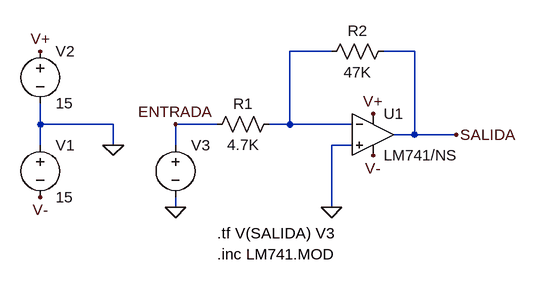
[diagram p0: schematic lm741-inversor-funcion-transferencia.asc]
lm741-inversor-funcion-transferencia.asc, the LTspice schematic file:
Version 4
SHEET 1 908 680
WIRE 352 48 288 48
WIRE 480 48 432 48
WIRE -96 160 -96 128
WIRE 16 160 -96 160
WIRE 176 160 112 160
WIRE 288 160 288 48
WIRE 288 160 256 160
WIRE 384 160 288 160
WIRE 480 176 480 48
WIRE 480 176 448 176
WIRE 544 176 480 176
WIRE -96 192 -96 160
WIRE 16 192 16 160
WIRE 112 192 112 160
WIRE 384 192 352 192
WIRE 112 288 112 272
WIRE 352 288 352 192
FLAG 112 288 0
FLAG 16 192 0
FLAG 544 176 SALIDA
FLAG -96 48 V+
FLAG 416 144 V+
FLAG -96 272 V-
FLAG 416 208 V-
FLAG 352 288 0
FLAG 112 160 ENTRADA
SYMBOL Opamps\\opamp2 416 112 R0
SYMATTR InstName U1
SYMATTR Value LM741/NS
SYMBOL voltage -96 176 R0
WINDOW 123 0 0 Left 0
WINDOW 39 0 0 Left 0
SYMATTR InstName V1
SYMATTR Value 15
SYMBOL voltage -96 32 R0
WINDOW 123 0 0 Left 0
WINDOW 39 0 0 Left 0
SYMATTR InstName V2
SYMATTR Value 15
SYMBOL voltage 112 176 R0
WINDOW 123 0 0 Left 0
WINDOW 39 0 0 Left 0
SYMATTR InstName V3
SYMATTR Value ""
SYMBOL res 448 32 R90
WINDOW 0 0 56 VBottom 2
WINDOW 3 32 56 VTop 2
SYMATTR InstName R2
SYMATTR Value 47K
SYMBOL res 272 144 R90
WINDOW 0 0 56 VBottom 2
WINDOW 3 32 56 VTop 2
SYMATTR InstName R1
SYMATTR Value 4.7K
TEXT 176 360 Left 2 !.inc LM741.MOD
TEXT 176 328 Left 2 !.tf V(SALIDA) V3

The netlist it stands for:
* lm741-inversor-funcion-transferencia.asc
XU1 0 N001 V+ V- SALIDA LM741/NS  ; pins In+ In- V+ V- OUT
V1 0 V- 15
V2 V+ 0 15
V3 ENTRADA 0
R2 SALIDA N001 47K
R1 N001 ENTRADA 4.7K
.inc LM741.MOD
.tf V(SALIDA) V3
.backanno
.end